# Altium schematic sheet Motor_Outputs.SchDoc
size A4; SheetNumber: 5; SheetTotal: 5
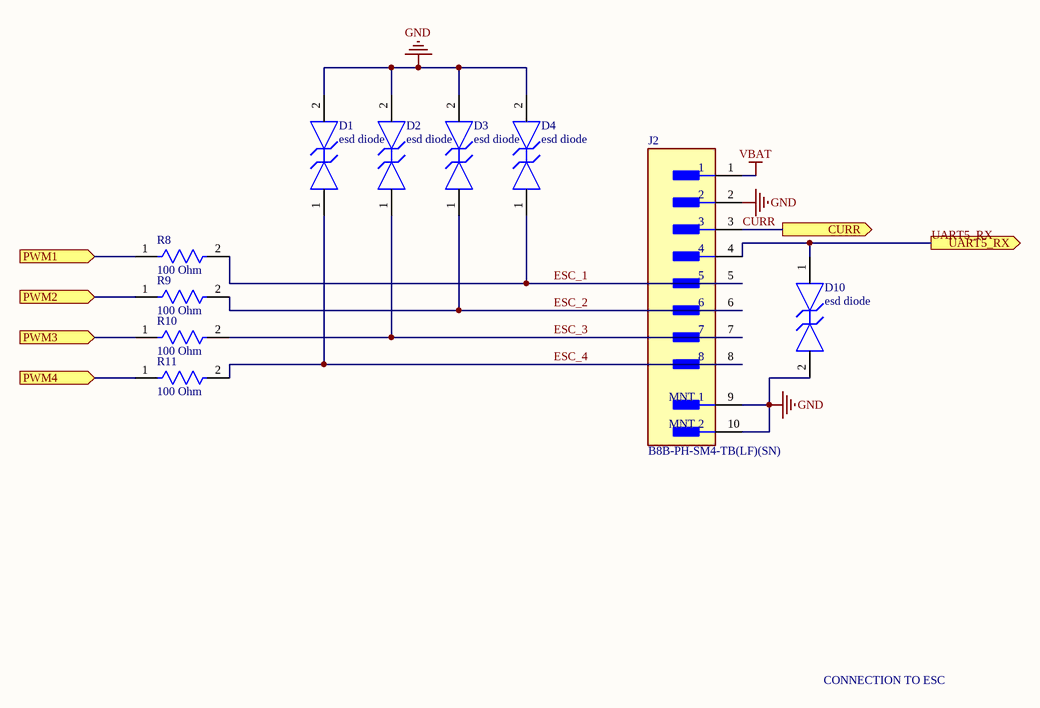
[diagram p0: Motor_Outputs.SchDoc]

## Parts
D1  esd diode  [FP-152AF-MFG]
D2  esd diode  [FP-152AF-MFG]
D3  esd diode  [FP-152AF-MFG]
D4  esd diode  [FP-152AF-MFG]
D10  esd diode  [FP-152AF-MFG]
J2  B8B-PH-SM4-TB(LF)(SN)  [FP-B8B-PH-SM4-TB_LF_SN-MFG]
R8  100 Ohm  [FP-MCS0402-IPC_A]
R9  100 Ohm  [FP-MCS0402-IPC_A]
R10  100 Ohm  [FP-MCS0402-IPC_A]
R11  100 Ohm  [FP-MCS0402-IPC_A]

## Ports
CURR (out, see EMP_FC_Main[2C], MCU_Core[5B]), PWM1 (in, see EMP_FC_Main[2C], MCU_Core[2B]), PWM2 (in, see EMP_FC_Main[2C], MCU_Core[2B]), PWM3 (in, see EMP_FC_Main[2C], MCU_Core[2B]), PWM4 (in, see EMP_FC_Main[2C], MCU_Core[2B]), UART5_RX (out, see EMP_FC_Main[2C], MCU_Core[1B])

## Nets
GND: D1.2 D2.2 D3.2 D4.2 D10.2 J2.2 J2.9(MNT_1) J2.10(MNT_2)
VBAT: J2.1
CURR: J2.3 ; port CURR
ESC_1: D4.1 J2.5 R8.2
ESC_2: D3.1 J2.6 R9.2
ESC_3: D2.1 J2.7 R10.2
ESC_4: D1.1 J2.8 R11.2
PWM1: R8.1 ; port PWM1
PWM2: R9.1 ; port PWM2
PWM3: R10.1 ; port PWM3
PWM4: R11.1 ; port PWM4
UART5_RX: D10.1 J2.4 ; port UART5_RX

## Notes on the sheet
- CONNECTION TO ESC

## Library data of the parts
D1-D4 D10 = CMP-07200-000010-1: TVS DIODE 5.3V 14V 2X3DFN; Number of Bidirectional Channels: 1; Element Configuration: Single; Capacitance: 0.3pF; Peak Pulse Current: 3A; Power Line Protection: No; Min Breakdown Voltage: 7V; Direction: Bidirectional; Case/Package: DFN; Lead Free: Lead Free; Reverse Standoff Voltage: 5.3V; Clamping Voltage: 14V; Resistor Type: Zener; Packaging: Tape and Reel; Mount: Surface Mount; Number of Pins: 2; Max Operating Temperature: 150°C; Min Operating Temperature: -55°C; Working Voltage: 5.3V; RoHS Compliant: Yes
J2 = CMP-17439-000195-1: CONN HEADER SMD 8POS 2MM; Current Rating: 2A; Insulation Resistance: 1GR; Mated Stacking Heights: 8.6mm; Gender: Male; Contact Resistance: 20mR; Number of Contacts: 8; Max Voltage Rating (AC): 100V; Pitch: 2mm; Fastening Type: Detent; Min Operating Temperature: -25°C; Contact Type: Male Pin; Series: PH; Contact Material: Copper Alloy; Termination: Solder; Contact Shape: Square; Depth: 5mm; Insulation Color: Natural; Housing Material: Polyamide; Max Current Rating: 2A; Color: White; Connector Type: Header; REACH SVHC: No SVHC; Insulation Material: Nylon; Number of Positions: 8; Height: 9.4mm; Width: 5.5mm; Max Operating Temperature: 85°C; Mount: Surface Mount; Orientation: Straight; Packaging: Tape and Reel; Working Voltage: 100V; Contact Mating Length: 0.13inch; Voltage Rating (AC): 100V; Housing Color: Beige; Length: 19.95mm; Contact Plating: Tin; Number of Poles: 8; Lead Free: Lead Free; Voltage Rating: 100V; Lead Pitch: 2mm; Contact Finish - Mating: TIN; Flammability Rating: UL94 V-0; Number of Rows: 1
R8-R11 = CMP-02407-000150-1: RES SMD 1.2K OHM 1% 1/10W 0402; Resistance: 100R; Max Power Dissipation: 200mW; Tolerance: 0.5%; Temperature Coefficient: 25ppm/°C; Packaging: Cut Tape; Min Operating Temperature: -55°C; Case Code (Imperial): 0402; Features: Automotive AEC-Q200; Case/Package: 0402; Number of Terminations: 2; Max Operating Temperature: 175°C; Composition: Thin Film; Case Code (Metric): 1005